# EAGLE design 505_outin_kinoma (EAGLE 9.6.2)
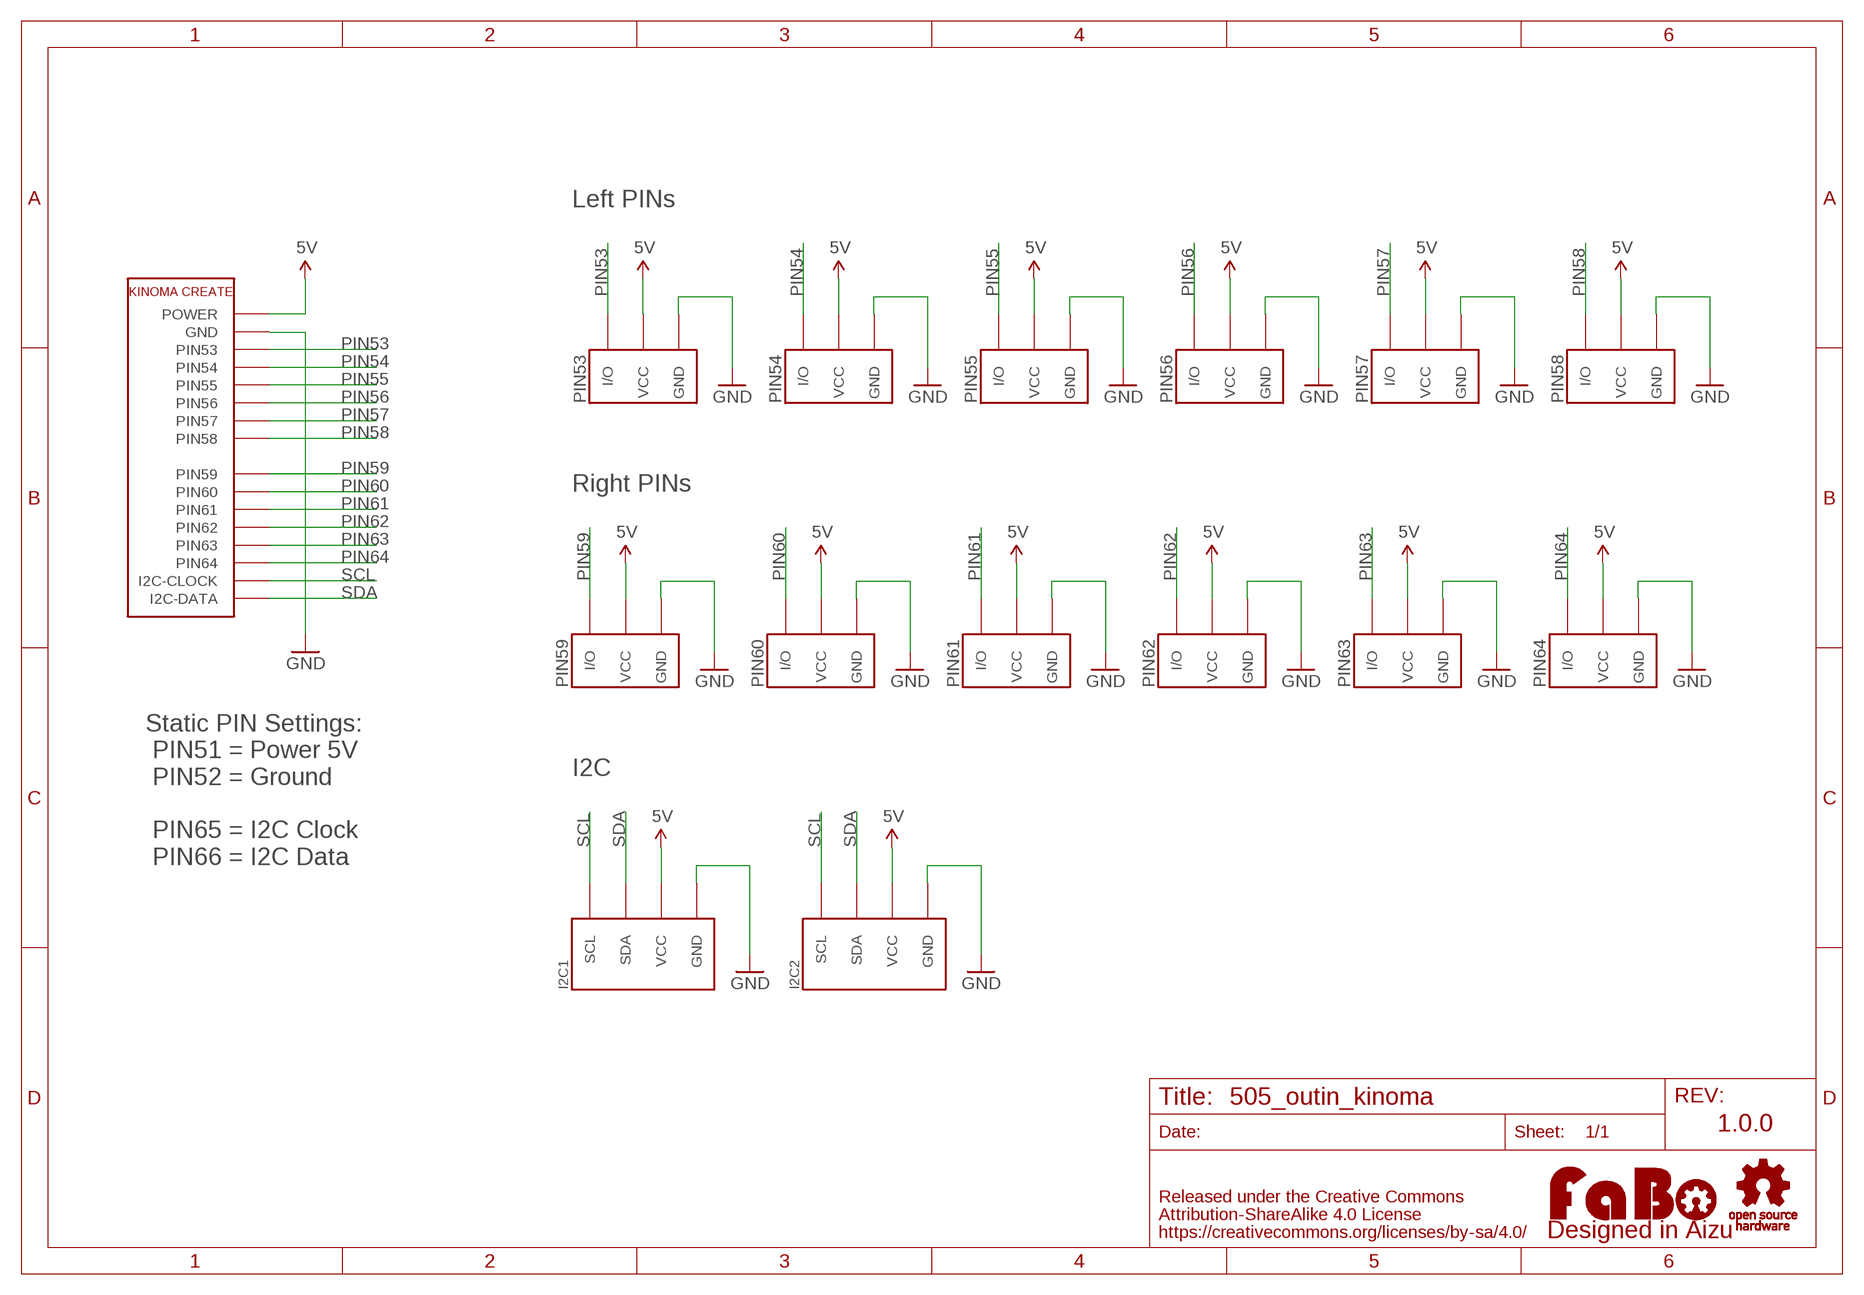
[diagram p0: schematic, sheet 1]

## Parts
I2C1  I2C  FABO_BRICK_I2C-S04B-PASK-2  [FABO_BRICK_I2C_S04B-PASK-2]
I2C2  I2C  FABO_BRICK_I2C-S04B-PASK-2  [FABO_BRICK_I2C_S04B-PASK-2]
LOGO1  LOGO_FABO-M  [LOGO_FABO_M]
PIN53  FABO_BRICK_3PIN-B03B-PASK-1  [FABO_BRICK_3PIN_B03B-PASK-1]
PIN54  FABO_BRICK_3PIN-B03B-PASK-1  [FABO_BRICK_3PIN_B03B-PASK-1]
PIN55  FABO_BRICK_3PIN-B03B-PASK-1  [FABO_BRICK_3PIN_B03B-PASK-1]
PIN56  FABO_BRICK_3PIN-B03B-PASK-1  [FABO_BRICK_3PIN_B03B-PASK-1]
PIN57  FABO_BRICK_3PIN-B03B-PASK-1  [FABO_BRICK_3PIN_B03B-PASK-1]
PIN58  FABO_BRICK_3PIN-B03B-PASK-1  [FABO_BRICK_3PIN_B03B-PASK-1]
PIN59  FABO_BRICK_3PIN-B03B-PASK-1  [FABO_BRICK_3PIN_B03B-PASK-1]
PIN60  FABO_BRICK_3PIN-B03B-PASK-1  [FABO_BRICK_3PIN_B03B-PASK-1]
PIN61  FABO_BRICK_3PIN-B03B-PASK-1  [FABO_BRICK_3PIN_B03B-PASK-1]
PIN62  FABO_BRICK_3PIN-B03B-PASK-1  [FABO_BRICK_3PIN_B03B-PASK-1]
PIN63  FABO_BRICK_3PIN-B03B-PASK-1  [FABO_BRICK_3PIN_B03B-PASK-1]
PIN64  FABO_BRICK_3PIN-B03B-PASK-1  [FABO_BRICK_3PIN_B03B-PASK-1]
U1  FABO-KINOMA  [FABO-KINOMA]
U$2  LOGO_OSHW-T_M  [LOGO_OSHW_T_MS]

## Nets
5V: I2C1.VCC I2C2.VCC PIN53.VCC PIN54.VCC PIN55.VCC PIN56.VCC PIN57.VCC PIN58.VCC PIN59.VCC PIN60.VCC PIN61.VCC PIN62.VCC PIN63.VCC PIN64.VCC U1.51(POWER)
GND: I2C1.GND I2C2.GND PIN53.GND PIN54.GND PIN55.GND PIN56.GND PIN57.GND PIN58.GND PIN59.GND PIN60.GND PIN61.GND PIN62.GND PIN63.GND PIN64.GND U1.52(GND)
PIN53: PIN53.I/O U1.53(PIN53)
PIN54: PIN54.I/O U1.54(PIN54)
PIN55: PIN55.I/O U1.55(PIN55)
PIN56: PIN56.I/O U1.56(PIN56)
PIN57: PIN57.I/O U1.57(PIN57)
PIN58: PIN58.I/O U1.58(PIN58)
PIN59: PIN59.I/O U1.59(PIN59)
PIN60: PIN60.I/O U1.60(PIN60)
PIN61: PIN61.I/O U1.61(PIN61)
PIN62: PIN62.I/O U1.62(PIN62)
PIN63: PIN63.I/O U1.63(PIN63)
PIN64: PIN64.I/O U1.64(PIN64)
SCL: I2C1.SCL I2C2.SCL U1.65(I2C-CLOCK)
SDA: I2C1.SDA I2C2.SDA U1.66(I2C-DATA)

## Notes on the sheet
- Left PINs
- Right PINs
- I2C
- Static PIN Settings:
   PIN51 = Power 5V
   PIN52 = Ground
  
   PIN65 = I2C Clock
   PIN66 = I2C Data
- 1.0.0

## Library data of the parts
I2C1 I2C2 = FaBo-Template:FABO_BRICK_I2C: FaBo Brick I2C
LOGO1 = component:LOGO_FABO
PIN53-PIN64 = FaBo-Template:FABO_BRICK_3PIN: FaBo Brick 3pin
U1 = FaBo-Template:FABO-KINOMA
U$2 = FaBo-etc:LOGO_OSHW

## Board
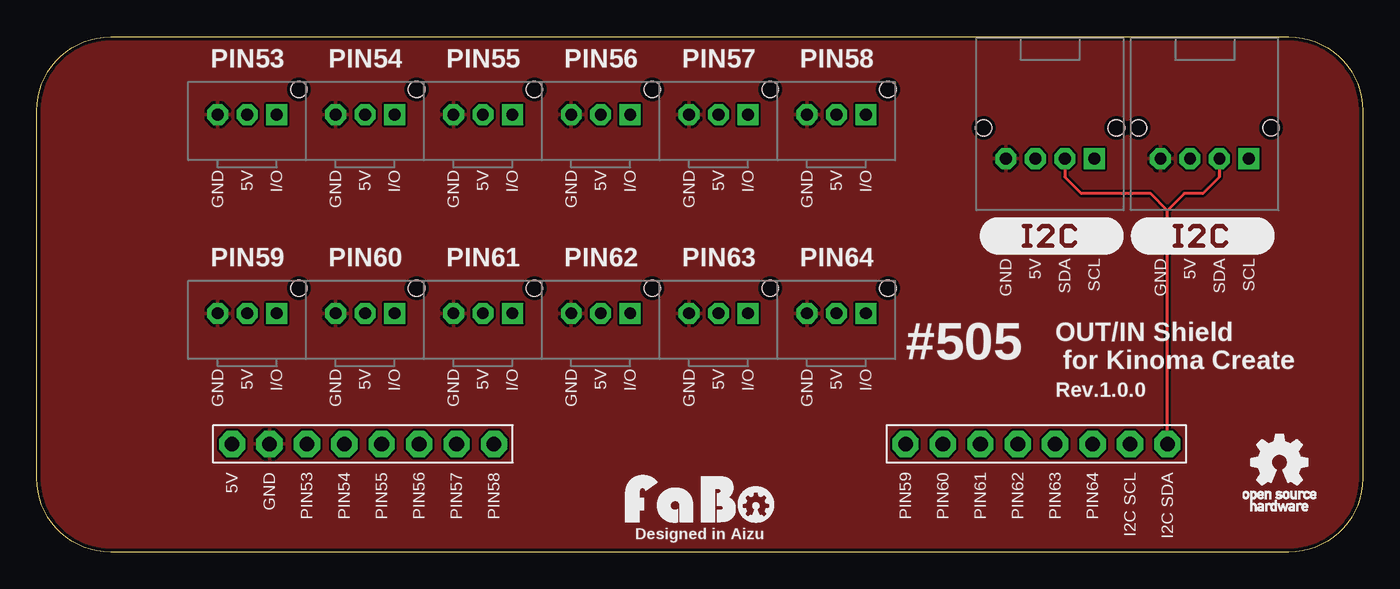
[diagram p1: board, top side]
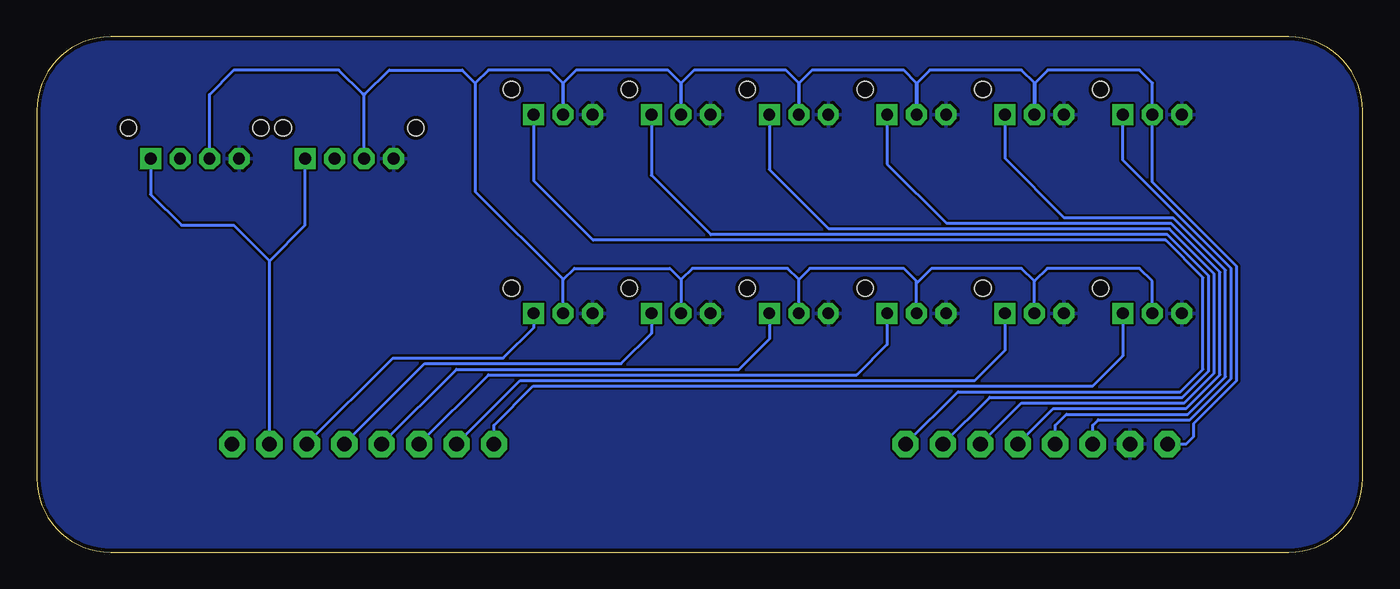
[diagram p2: board, bottom side, seen from below]

Size 90 x 35 mm. Coordinates in mm from the lower left corner, seen from the top.
Copper layers (1*16): Top 0.035mm / dielectric 1.6mm / Bottom 0.035mm
Design rules "PCBway": minimum track width 6mil, minimum drill 12mil, track to track 6mil, track to pad 6mil, pad to pad 6mil, via to via 6mil, smd to smd 6mil, copper to edge 10mil, drill to drill 10mil, minimum pad ring 10mil, minimum via ring 6mil, stop-mask expansion 2mil, vias tented up to drill 100mil, thermal gap 8mil

### Footprints (pad centres in the part's own frame; a part is rotated, then mirrored left to right if it is on the bottom)
FABO_BRICK_I2C_S04B-PASK-2 = drill 0.8 pad 1.422 octagon: GND -3,0; SDA 1,0; VCC -1,0 | drill 0.8 pad 1.422 square: SCL 3,0 | hole 1.1: 4.5,2.1; -4.5,2.1
FABO_BRICK_3PIN_B03B-PASK-1 = drill 0.8 pad 1.422 octagon: GND -2,0; VCC 0,0 | drill 0.8 pad 1.422 square: I/O 2,0 | hole 1.1: 3.5,1.7
FABO-KINOMA = drill 1 pad 1.778 octagon: 51 -31.75,-10.16; 52 -29.21,-10.16; 53 -26.67,-10.16; 54 -24.13,-10.16; 55 -21.59,-10.16; 56 -19.05,-10.16; 57 -16.51,-10.16; 58 -13.97,-10.16; 59 13.97,-10.16; 60 16.51,-10.16; 61 19.05,-10.16; 62 21.59,-10.16; 63 24.13,-10.16; 64 26.67,-10.16; 65 29.21,-10.16; 66 31.75,-10.16

### Placement (x,y rotation side)
I2C1  79.28,26.72 0 top
I2C2  68.78,26.72 0 top
LOGO1  45,1.62 0 top
PIN53  14.28,29.72 0 top
PIN54  22.28,29.72 0 top
PIN55  30.28,29.72 0 top
PIN56  38.28,29.72 0 top
PIN57  46.28,29.72 0 top
PIN58  54.28,29.72 0 top
PIN59  14.28,16.22 0 top
PIN60  22.28,16.22 0 top
PIN61  30.28,16.22 0 top
PIN62  38.28,16.22 0 top
PIN63  46.28,16.22 0 top
PIN64  54.28,16.22 0 top
U1  45,17.5 0 top
U$2  84.37,6.07 0 top
U$4  [LOGO_SILK_I2C]  74.28,20.22 0 top
U$5  [LOGO_SILK_I2C]  64.03,20.22 0 top

### Tracks (layer width: path | path; a pad name or v marks a point on that pad's centre or on a via)
5V
  Bottom 0.203: U1.51 11.98,7.34 11.47,7.85 11.47,8.74 8.55,11.66 8.55,19.4 14.28,25.13 PIN53.VCC 14.27,29.73 14.27,31.85 15.16,32.74 21.38,32.74 22.27,31.85 | 22.27,31.85 22.27,29.73 PIN54.VCC 22.28,31.84 22.27,31.85 | 22.27,31.85 23.16,32.74 29.38,32.74 30.27,31.85 30.27,29.73 PIN55.VCC 30.28,31.86 31.16,32.74 37.38,32.74 38.27,31.85 | 38.27,31.85 38.27,29.73 PIN56.VCC 38.28,31.84 38.27,31.85 | 38.27,31.85 39.16,32.74 45.38,32.74 46.27,31.85 PIN57.VCC 46.28,31.86 47.16,32.74 53.38,32.74 54.27,31.85 PIN58.VCC 54.28,31.86 55.16,32.74 59.35,32.74 60.24,31.85 | 60.24,31.85 60.24,24.48 54.26,18.51 54.28,18.51 | PIN64.VCC 54.28,18.51 | 54.28,18.51 53.51,19.28 47.03,19.28 46.27,18.52 | 46.27,18.52 PIN63.VCC | 60.24,31.85 61.13,32.74 66.08,32.74 67.73,31.09 | PIN62.VCC 38.28,18.53 | 38.28,18.53 39.03,19.28 45.51,19.28 46.27,18.52 | PIN61.VCC 30.28,18.26 | 30.28,18.26 30.28,18.4 31.16,19.28 37.53,19.28 38.28,18.53 | PIN60.VCC 22.28,18.4 | 22.28,18.4 23.16,19.28 29.26,19.28 30.28,18.26 | PIN59.VCC 14.28,18.4 15.16,19.28 21.4,19.28 22.28,18.4 | I2C2.VCC 67.78,31.04 67.73,31.09 | 67.73,31.09 67.86,31.09 69.51,32.74 76.62,32.74 78.28,31.08 I2C1.VCC
GND
  pour Bottom: -0.08,-0.28 90.72,-0.28 90.72,35.28 -0.08,35.28
  pour Top: -0.08,-0.28 90.72,-0.28 90.72,35.28 -0.08,35.28
PIN53
  Bottom 0.203: U1.53 18.33,8.61 17.95,8.99 11.73,8.99 8.93,11.78 8.93,19.28 16.28,26.63 PIN53.I/O
PIN54
  Bottom 0.203: U1.54 20.87,8.61 20.11,9.37 11.85,9.37 9.31,11.91 9.31,19.15 12.87,22.71 20.23,22.71 24.28,26.75 PIN54.I/O
PIN55
  Bottom 0.203: U1.55 21,9.75 11.98,9.75 9.69,12.04 9.69,19.02 13,22.33 28.24,22.33 32.28,26.37 PIN55.I/O
PIN56
  Bottom 0.203: U1.56 23.16,10.13 12.11,10.13 10.08,12.17 10.08,18.9 13.12,21.95 36.24,21.95 40.28,25.99 PIN56.I/O
PIN57
  Bottom 0.203: U1.57 25.32,10.51 12.23,10.51 10.46,12.29 10.46,18.77 13.25,21.56 44.24,21.56 48.28,25.61 PIN57.I/O
PIN58
  Bottom 0.203: U1.58 27.47,10.9 12.36,10.9 10.84,12.42 10.84,18.64 13.38,21.18 52.24,21.18 56.28,25.22 PIN58.I/O
PIN59
  Bottom 0.203: U1.59 58.97,8.61 56.3,11.28 18.33,11.28 16.28,13.33 PIN59.I/O
PIN60
  Bottom 0.203: U1.60 57.19,11.66 26.33,11.66 24.28,13.71 PIN60.I/O
PIN61
  Bottom 0.203: U1.61 59.35,12.04 34.33,12.04 32.28,14.09 PIN61.I/O
PIN62
  Bottom 0.203: U1.62 61.51,12.42 42.33,12.42 40.28,14.47 PIN62.I/O
PIN63
  Bottom 0.203: U1.63 63.67,12.8 50.33,12.8 48.28,14.85 PIN63.I/O
PIN64
  Bottom 0.203: U1.64 65.83,13.18 58.34,13.18 56.28,15.24 PIN64.I/O
SCL
  Bottom 0.203: U1.65 74.21,19.79 | 74.21,19.79 71.8,22.2 71.8,26.7 I2C2.SCL | 74.21,19.79 76.62,22.2 80.18,22.2 82.28,24.3 I2C1.SCL
SDA
  Top 0.203: U1.66 76.75,23.21 | 76.75,23.21 77.89,24.36 79.16,24.36 80.28,25.47 I2C1.SDA | 76.75,23.21 75.61,24.36 70.91,24.36 69.78,25.49 I2C2.SDA

### Text on the board
tPlace: GND | 5V | I/O | GND | 5V | I/O | GND | 5V | I/O | GND | 5V | I/O | GND | 5V | I/O | GND | 5V | I/O | GND | 5V | SDA | SCL | GND | 5V | SDA | SCL | GND | 5V | I/O | GND | 5V | I/O | GND | 5V | I/O | GND | 5V | I/O | GND | 5V | I/O | GND | 5V | I/O | #505 | OUT/IN Shield / for Kinoma Create | Rev.1.0.0 | 5V | GND | PIN53 | PIN54 | PIN55 | PIN56 | PIN57 | PIN58 | PIN59 | PIN60 | PIN61 | PIN62 | PIN63 | PIN64 | I2C SCL | I2C SDA | Designed in Aizu